# Altium schematic sheet Cover.SchDoc: ECSE478 - DAQ Device
size B; DrawnBy: Jasper Yun; SheetNumber: 1; SheetTotal: 13; Competition: SAC 2021; Subteam: Avionics; University: McGill University; Location: Montreal, Quebec; Project: Avionics Project Name; MRT: McGill Rocket Team
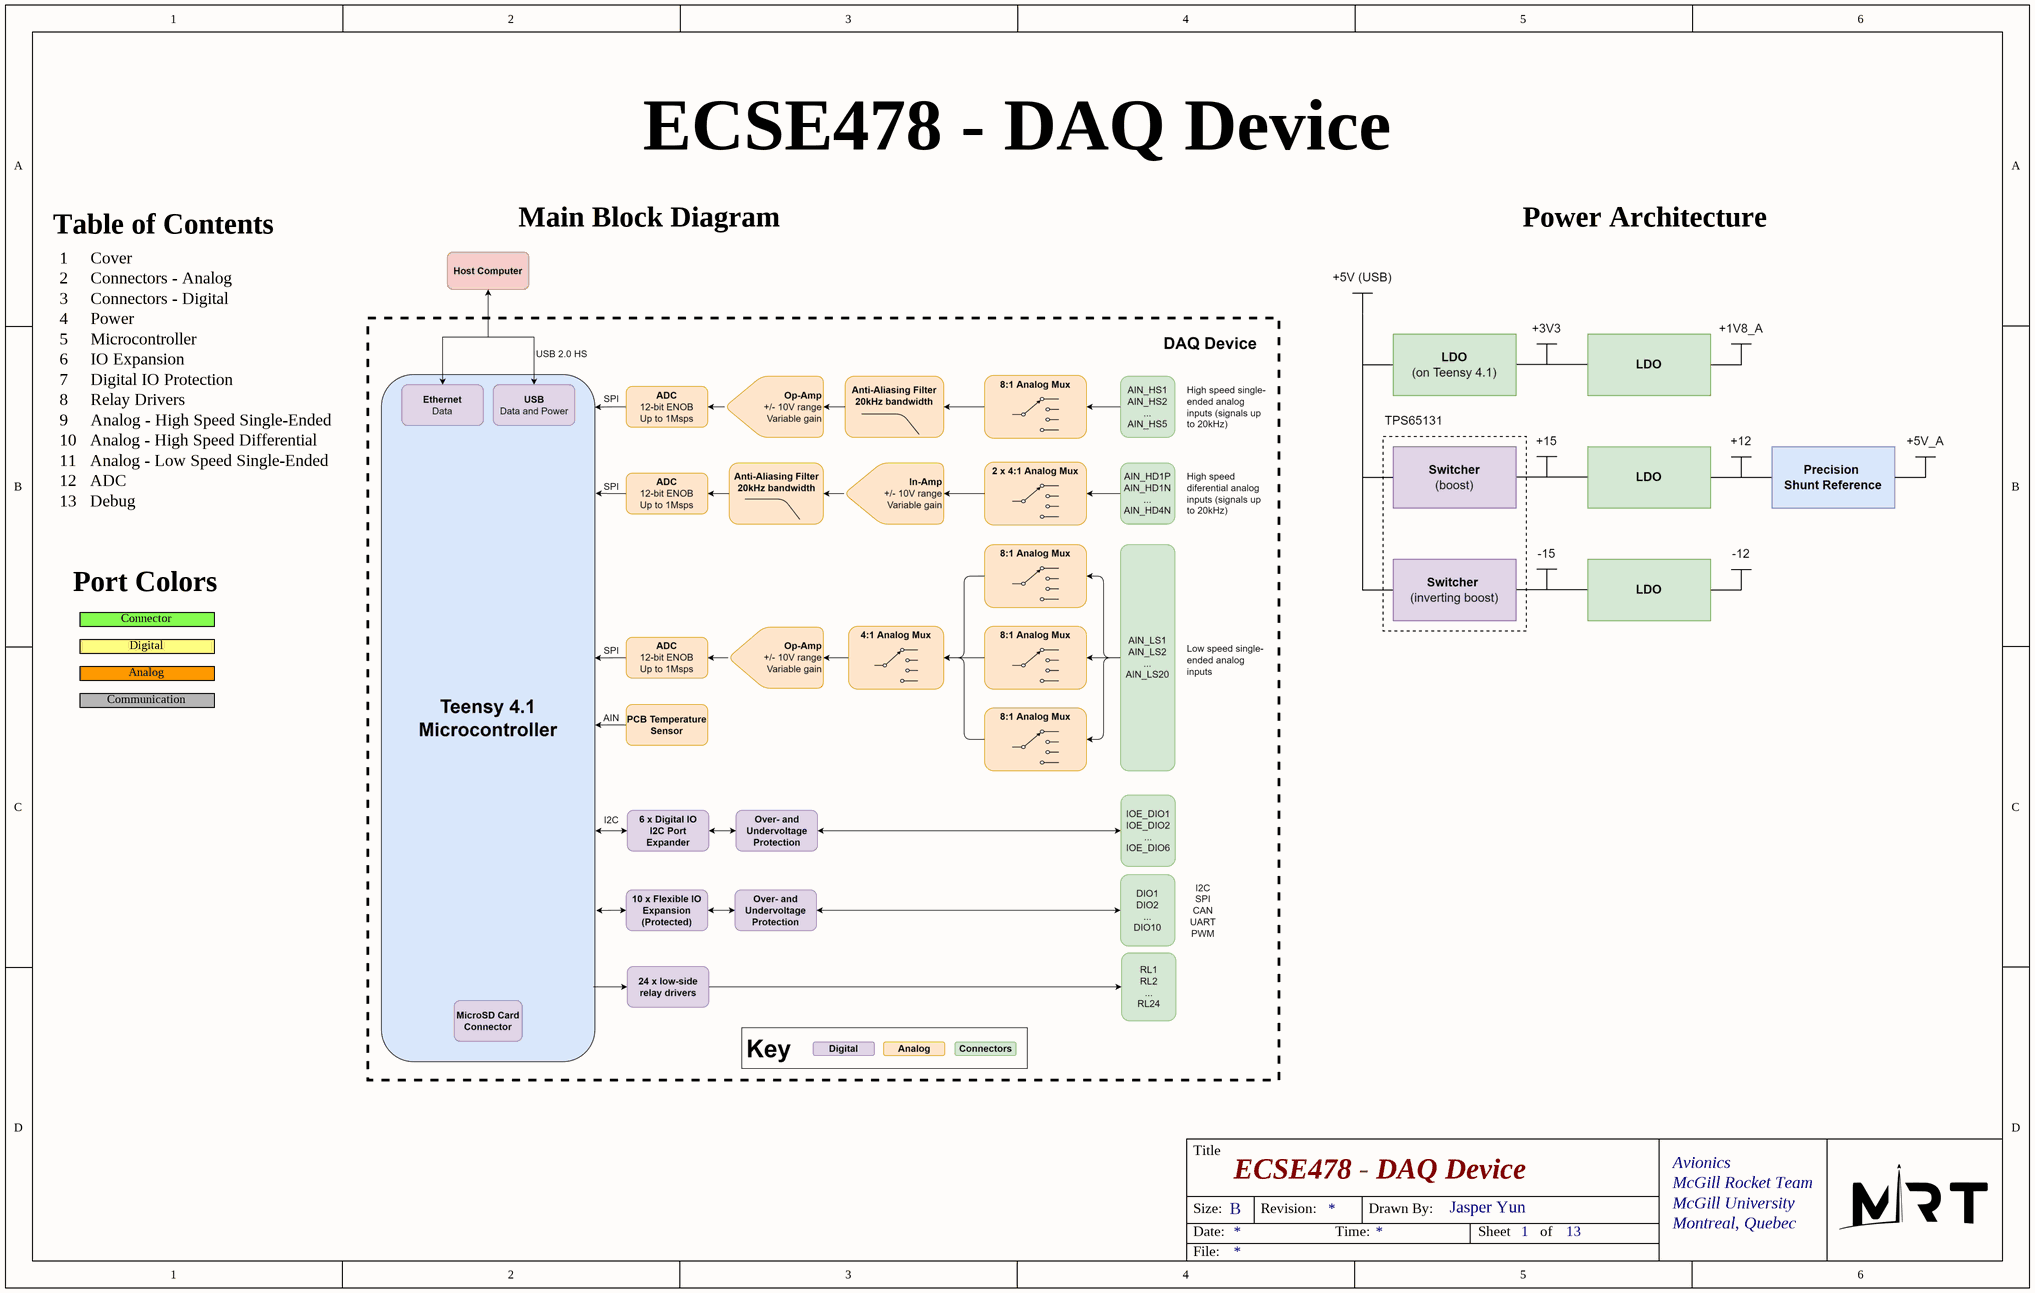
[diagram p0: Cover.SchDoc]

## Notes on the sheet
- Table of Contents
- Main Block Diagram
- Power Architecture
- 1     Cover
- 2     Connectors - Analog
- 3     Connectors - Digital
- 4     Power
- 5     Microcontroller
- 6     IO Expansion
- 7     Digital IO Protection
- 8     Relay Drivers
- 9     Analog - High Speed Single-Ended
- 10   Analog - High Speed Differential
- 11   Analog - Low Speed Single-Ended
- 12   ADC
- 13   Debug
- Port Colors
- Connector
- Digital
- Analog
- Communication
- Title
- Size:
- Date:
- B
- Revision:
- Time:
- Drawn By:
- Sheet
- of
- File: